# EAGLE design reader (EAGLE 9.2.2)
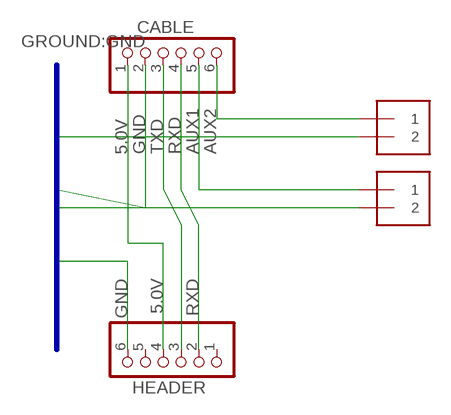
[diagram p0: schematic, sheet 1]

## Parts
AUX1  1X2-3.5MM  [1X2-3.5MM]
AUX2  1X2-3.5MM  [1X2-3.5MM]
CABLE  PINHD-1X6  [1X06]
HEADER  PINHD-1X6  [1X06]

## Nets
5.0V: CABLE.1 HEADER.4
AUX1: AUX1.1 CABLE.5
AUX2: AUX2.1 CABLE.6
GND: AUX1.2 AUX2.2 CABLE.2 HEADER.6
RXD: CABLE.4 HEADER.2
TXD: CABLE.3 HEADER.3
Unconnected: HEADER.1 HEADER.5

## Buses
GROUND:GND

## Library data of the parts
AUX1 AUX2 = adafruit:1X2: 3.5mm Terminal block http://www.ladyada.net/library/pcb/eaglelibrary.html
CABLE HEADER = adafruit:PINHD-1X6: PIN HEADER

## Board
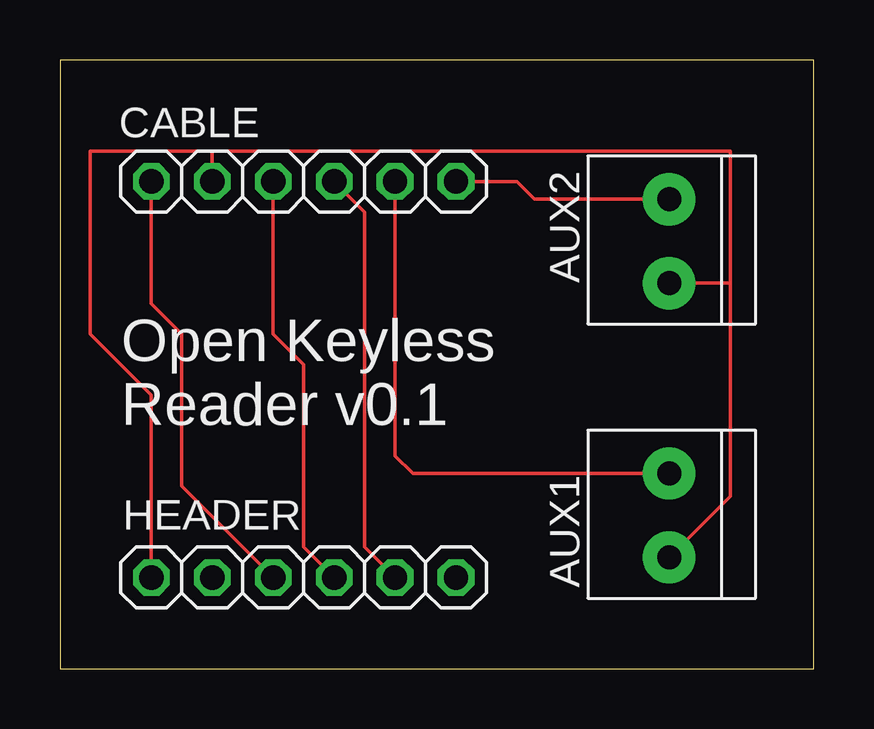
[diagram p1: board, top side]
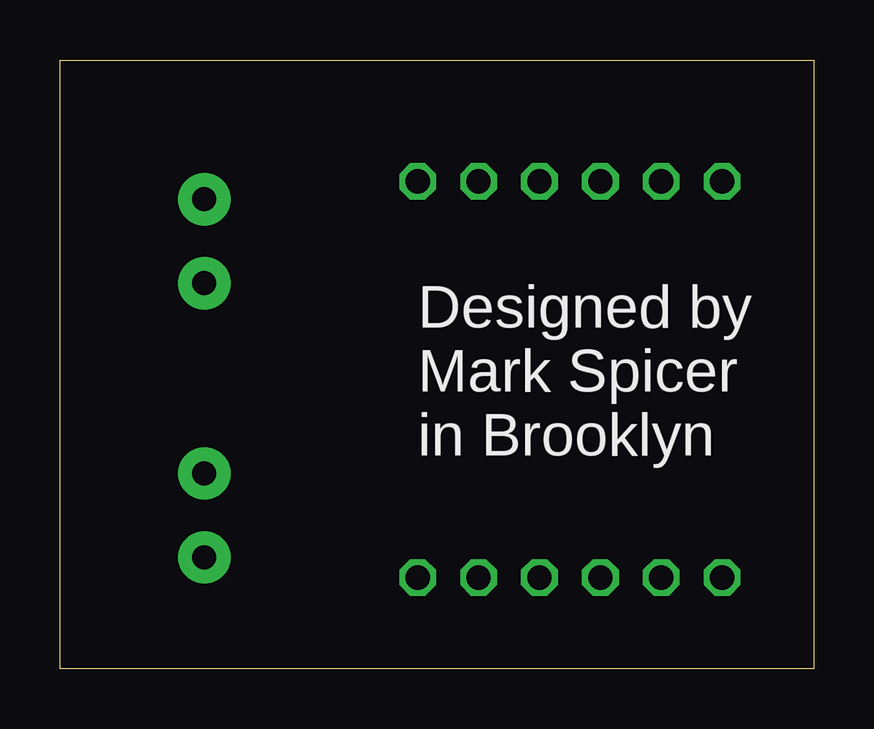
[diagram p2: board, bottom side, seen from below]

Size 31.42 x 25.39 mm. Coordinates in mm from the lower left corner, seen from the top.
Outline: 0,0 31.42,0 31.42,25.39 0,25.39 0,0
Copper layers (1*16): Top 0.035mm / dielectric 1.5mm / Bottom 0.035mm
Design rules "default": minimum track width 6mil, minimum drill 0.35mm, track to track 6mil, track to pad 6mil, pad to pad 6mil, via to via 6mil, smd to smd 6mil, copper to edge 40mil, drill to drill 6mil, minimum pad ring 10mil, minimum via ring 8mil, stop-mask expansion 4mil, vias tented up to drill 0mil, thermal gap 10mil

### Footprints (pad centres in the part's own frame; a part is rotated, then mirrored left to right if it is on the bottom)
1X2-3.5MM = drill 1 pad 2.184: 1 1.8,0; 2 -1.7,0
1X06 = drill 1.016 octagon: 1 -6.35,0; 2 -3.81,0; 3 -1.27,0; 4 1.27,0; 5 3.81,0; 6 6.35,0

### Placement (x,y rotation side)
AUX1  25.4,6.35 90 top
AUX2  25.4,17.78 90 top
CABLE  10.16,20.32 0 top
HEADER  10.16,3.81 180 top

### Tracks (layer width: path | path; a pad name or v marks a point on that pad's centre or on a via)
5.0V
  Top 0.152: HEADER.4 5.08,7.62 5.08,13.97 3.81,15.24 CABLE.1
AUX1
  Top 0.152: AUX1.1 14.71,8.15 13.97,8.89 CABLE.5
AUX2
  Top 0.152: CABLE.6 19.05,20.32 19.79,19.58 AUX2.1
GND
  Top 0.152: 6.35,21.59 1.27,21.59 1.27,13.97 3.81,11.43 HEADER.6 | 6.35,21.59 CABLE.2 | 6.35,21.59 27.94,21.59 27.94,16.08 | AUX2.2 27.94,16.08 | AUX1.2 27.94,7.19 27.94,16.08
RXD
  Top 0.152: CABLE.4 12.7,19.05 12.7,5.08 HEADER.2
TXD
  Top 0.152: HEADER.3 10.16,5.08 10.16,12.7 8.89,13.97 CABLE.3

### Text on the board
tPlace: Open Keyless / Reader v0.1
bPlace: Designed by / Mark Spicer / in Brooklyn